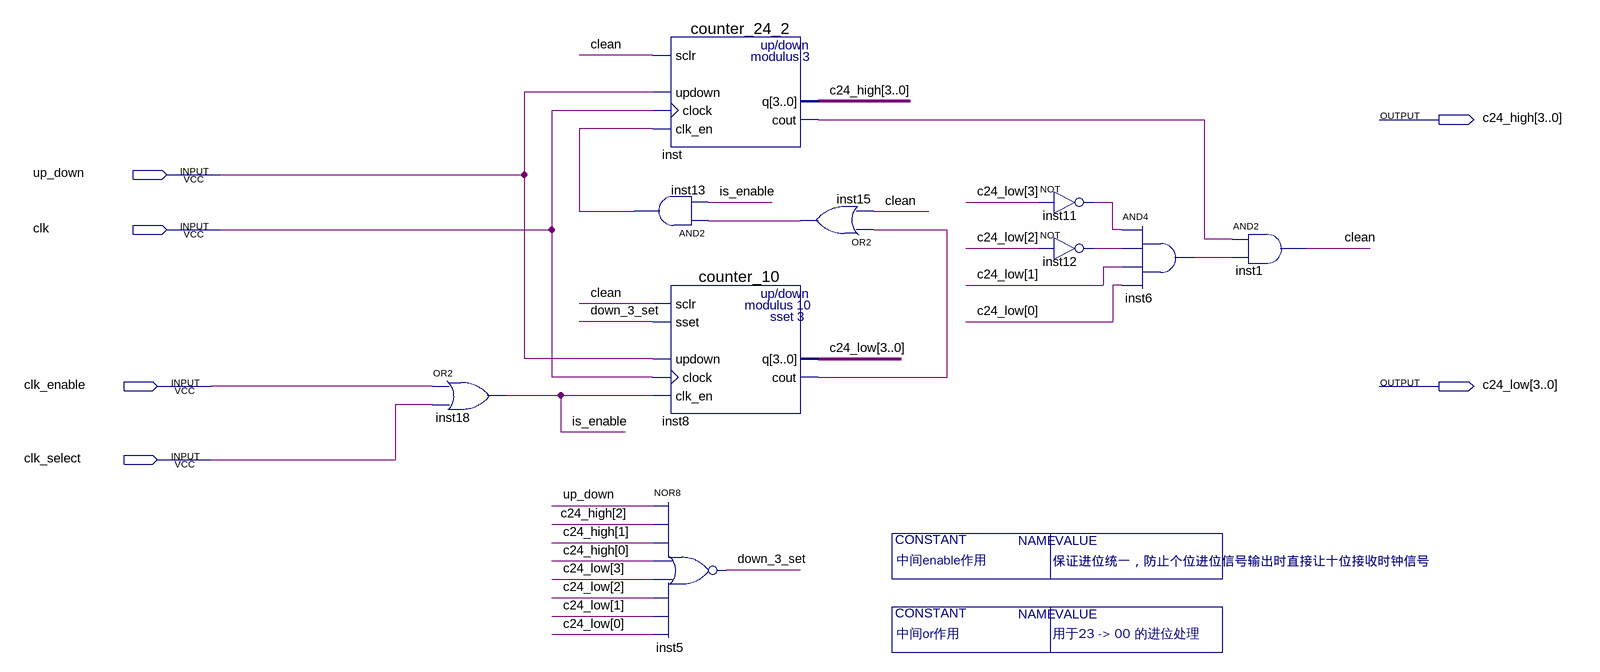
[diagram p0: schematic sheet]
// Quartus schematic counter_24.bdf as structural Verilog: 10 symbols, 6 pins
module counter_24 #(parameter \中间enable作用  = "保证进位统一，防止个位进位信号输出时直接让十位接收时钟信号", parameter \中间or作用  = "用于23 -> 00 的进位处理") (
  input  up_down,
  input  clk,
  input  clk_enable,
  input  clk_select,
  output [3:0] c24_high,
  output [3:0] c24_low
);

  wire clean, down_3_set, inst6_out, inst8_cout, inst11_out, inst12_out, inst13_out, inst15_out, inst_cout,
       is_enable;

  or inst18 (is_enable, clk_enable, clk_select);
  and inst13 (inst13_out, inst15_out, is_enable);
  counter_24_2 inst (.sclr(clean), .updown(up_down), .clock(clk), .clk_en(inst13_out), .q(c24_high), .cout(inst_cout));
  counter_10 inst8 (
    .sclr(clean), .sset(down_3_set), .updown(up_down), .clock(clk), .clk_en(is_enable), .q(c24_low),
    .cout(inst8_cout));
  nor inst5 (down_3_set, up_down, c24_high[2], c24_high[1], c24_high[0], c24_low[3], c24_low[2], c24_low[1], c24_low[0]);
  or inst15 (inst15_out, inst8_cout, clean);
  not inst11 (inst11_out, c24_low[3]);
  not inst12 (inst12_out, c24_low[2]);
  and inst6 (inst6_out, inst11_out, inst12_out, c24_low[1], c24_low[0]);
  and inst1 (clean, inst_cout, inst6_out);
endmodule
